# Altium schematic sheet 创世一号_主控.SchDoc
size 549 x 350 mm
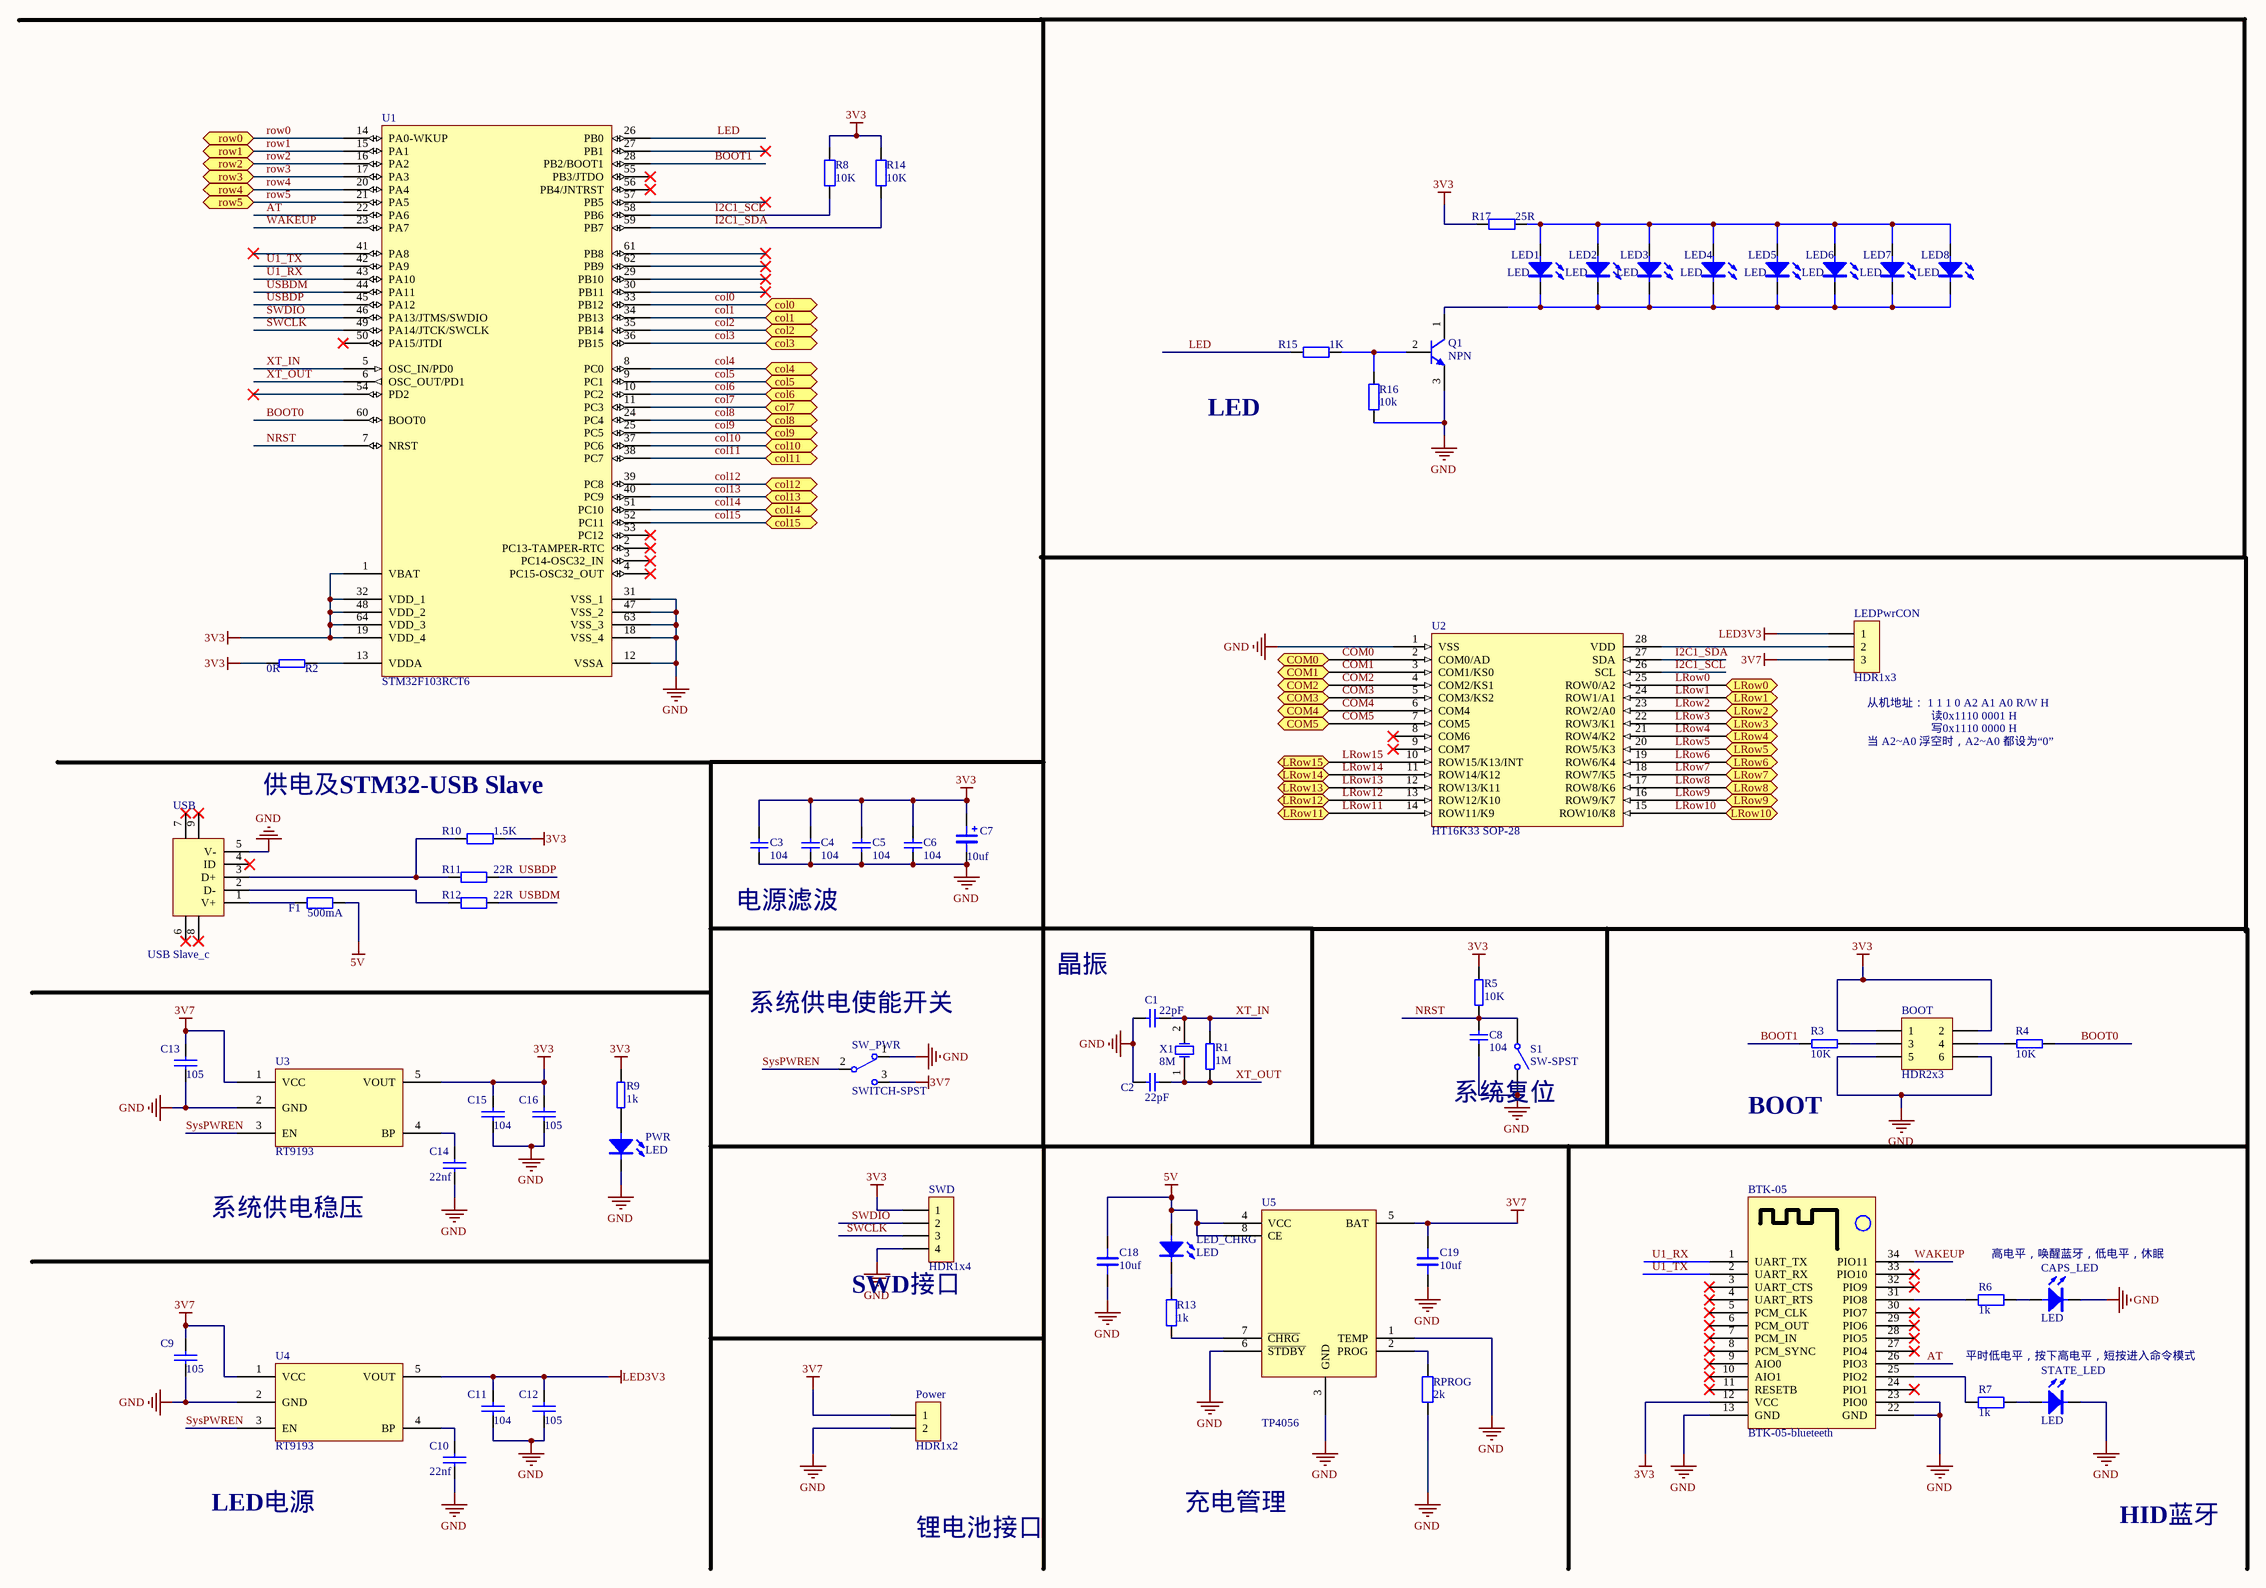
[diagram p0: 创世一号_主控.SchDoc]

## Parts
BOOT  HDR2x3  [PIN-2x3-2.54-1.0]
BTK-05  BTK-05-blueteeth  [BTK-05-bluteeth]
C1  22pF  [RC0603]
C2  22pF  [RC0603]
C3  104  [RC0603]
C4  104  [RC0603]
C5  104  [RC0603]
C6  104  [RC0603]
C7  10uf  [CAP0805]
C8  104  [RC0603]
C9  105  [0603]
C10  22nf  [0603]
C11  104  [0603]
C12  105  [0603]
C13  105  [0603]
C14  22nf  [0603]
C15  104  [0603]
C16  105  [0603]
C18  10uf  [0805]
C19  10uf  [0805]
CAPS_LED  LED  [LED-0805]
F1  500mA  [0805]
LED1  LED  [LED-0805]
LED2  LED  [LED-0805]
LED3  LED  [LED-0805]
LED4  LED  [LED-0805]
LED5  LED  [LED-0805]
LED6  LED  [LED-0805]
LED7  LED  [LED-0805]
LED8  LED  [LED-0805]
LED_CHRG  LED  [LED-0805]
LEDPwrCON  HDR1x3  [PIN-3-2.54-1.0]
Power  HDR1x2  [PIN-2-2.54-1.0]
PWR  LED  [LED-0805]
Q1  NPN  [S8050-TO-92]
R1  1M  [RC0603]
R2  0R  [RC0603]
R3  10K  [RC0603]
R4  10K  [RC0603]
R5  10K  [RC0603]
R6  1k  [0603]
R7  1k  [0603]
R8  10K  [0603]
R9  1k  [0603]
R10  1.5K  [0603]
R11  22R  [0603]
R12  22R  [0603]
R13  1k  [0603]
R14  10K  [0603]
R15  1K  [0603]
R16  10k  [0603]
R17  25R  [0603]
RPROG  2k  [0603]
S1  SW-SPST  [SMT-KEY]
STATE_LED  LED  [LED-0805]
SW_PWR  SWITCH-SPST  [Switch_3p_2.5mmjianju]
SWD  HDR1x4  [PIN-4-2.54-1.0]
U1  STM32F103RCT6  [QFP-64-0.5]
U2  HT16K33 SOP-28  [HT16K33-28PIN-SOP28]
U3  RT9193  [SOT-23-5]
U4  RT9193  [SOT-23-5]
U5  TP4056  [ESOP8]
USB  USB Slave_c  [MICRO USB CONNECTOR TYPEB-ST-MC-5F-01]
X1  8M  [HC49-SMD]

## Ports
col0 (bidir), col1 (bidir), col2 (bidir), col3 (bidir), col4 (bidir), col5 (bidir), col6 (bidir), col7 (bidir), col8 (bidir), col9 (bidir), col10 (bidir), col11 (bidir), col12 (bidir), col13 (bidir), col14 (bidir), col15 (bidir), COM0 (bidir), COM1 (bidir), COM2 (bidir), COM3 (bidir), COM4 (bidir), COM5 (bidir), LRow0 (bidir), LRow1 (bidir), LRow2 (bidir), LRow3 (bidir), LRow4 (bidir), LRow5 (bidir), LRow6 (bidir), LRow7 (bidir), LRow8 (bidir), LRow9 (bidir), LRow10 (bidir), LRow11 (bidir), LRow12 (bidir), LRow13 (bidir), LRow14 (bidir), LRow15 (bidir), row0 (bidir), row1 (bidir), row2 (bidir), row3 (bidir), row4 (bidir), row5 (bidir)

## Nets
3V3: BOOT.1 BOOT.2 BTK-05.12(VCC) C3.1 C4.1 C5.1 C6.1 C7.1 C15.1 C16.1 R2.2 R5.2 R8.1 R9.2 R10.1 R14.1 R17.2 SWD.1 U1.1(VBAT) U1.19(VDD_4) U1.32(VDD_1) U1.48(VDD_2) U1.64(VDD_3) U3.5(VOUT)
3V7: C9.1 C13.1 C19.2 LEDPwrCON.3 Power.1 SW_PWR.3 U3.1(VCC) U4.1(VCC) U5.5(BAT)
5V: C18.2 F1.1 LED_CHRG.1(A) U5.4(VCC) U5.8(CE)
GND: BOOT.5 BOOT.6 BTK-05.13(GND) BTK-05.22(GND) BTK-05.23(PIO0) C1.2 C2.2 C3.2 C4.2 C5.2 C6.2 C7.2 C8.2 C9.2 C10.2 C11.2 C12.2 C13.2 C14.2 C15.2 C16.2 C18.1 C19.1 CAPS_LED.2(C) Power.2 PWR.2(C) Q1.3(E) R16.2 RPROG.1 S1.2(NO) STATE_LED.2(C) SW_PWR.1 SWD.4 U1.12(VSSA) U1.18(VSS_4) U1.31(VSS_1) U1.47(VSS_2) U1.63(VSS_3) U2.1(VSS) U3.2(GND) U4.2(GND) U5.1(TEMP) U5.3(GND) U5.6(~{STDBY}) USB.5(V-)
LED3V3: C11.1 C12.1 LEDPwrCON.1 U4.5(VOUT)
AT: BTK-05.26(PIO3) U1.22(PA6)
BOOT0: R4.1 U1.60(BOOT0)
BOOT1: R3.2 U1.28(PB2/BOOT1)
col0: U1.33(PB12) ; port col0
col1: U1.34(PB13) ; port col1
col2: U1.35(PB14) ; port col2
col3: U1.36(PB15) ; port col3
col4: U1.8(PC0) ; port col4
col5: U1.9(PC1) ; port col5
col6: U1.10(PC2) ; port col6
col7: U1.11(PC3) ; port col7
col8: U1.24(PC4) ; port col8
col9: U1.25(PC5) ; port col9
col10: U1.37(PC6) ; port col10
col11: U1.38(PC7) ; port col11
col12: U1.39(PC8) ; port col12
col13: U1.40(PC9) ; port col13
col14: U1.51(PC10) ; port col14
col15: U1.52(PC11) ; port col15
COM0: U2.2(COM0/AD) ; port COM0
COM1: U2.3(COM1/KS0) ; port COM1
COM2: U2.4(COM2/KS1) ; port COM2
COM3: U2.5(COM3/KS2) ; port COM3
COM4: U2.6(COM4) ; port COM4
COM5: U2.7(COM5) ; port COM5
I2C1_SCL: R8.2 U1.58(PB6) U2.26(SCL)
I2C1_SDA: R14.2 U1.59(PB7) U2.27(SDA)
LED: R15.2 U1.26(PB0)
LRow0: U2.25(ROW0/A2) ; port LRow0
LRow1: U2.24(ROW1/A1) ; port LRow1
LRow2: U2.23(ROW2/A0) ; port LRow2
LRow3: U2.22(ROW3/K1) ; port LRow3
LRow4: U2.21(ROW4/K2) ; port LRow4
LRow5: U2.20(ROW5/K3) ; port LRow5
LRow6: U2.19(ROW6/K4) ; port LRow6
LRow7: U2.18(ROW7/K5) ; port LRow7
LRow8: U2.17(ROW8/K6) ; port LRow8
LRow9: U2.16(ROW9/K7) ; port LRow9
LRow10: U2.15(ROW10/K8) ; port LRow10
LRow11: U2.14(ROW11/K9) ; port LRow11
LRow12: U2.13(ROW12/K10) ; port LRow12
LRow13: U2.12(ROW13/K11) ; port LRow13
LRow14: U2.11(ROW14/K12) ; port LRow14
LRow15: U2.10(ROW15/K13/INT) ; port LRow15
NRST: C8.1 R5.1 S1.1(COMMON) U1.7(NRST)
row0: U1.14(PA0-WKUP) ; port row0
row1: U1.15(PA1) ; port row1
row2: U1.16(PA2) ; port row2
row3: U1.17(PA3) ; port row3
row4: U1.20(PA4) ; port row4
row5: U1.21(PA5) ; port row5
SWCLK: SWD.3 U1.49(PA14/JTCK/SWCLK)
SWDIO: SWD.2 U1.46(PA13/JTMS/SWDIO)
SysPWREN: SW_PWR.2 U3.3(EN) U4.3(EN)
U1_RX: BTK-05.1(UART_TX) U1.43(PA10)
U1_TX: BTK-05.2(UART_RX) U1.42(PA9)
USBDM: R12.1 U1.44(PA11)
USBDP: R11.1 U1.45(PA12)
WAKEUP: BTK-05.34(PIO11) U1.23(PA7)
XT_IN: C1.1 R1.2 U1.5(OSC_IN/PD0) X1.2
XT_OUT: C2.1 R1.1 U1.6(OSC_OUT/PD1) X1.1
NetBOOT_3: BOOT.3 R3.1
NetBOOT_4: BOOT.4 R4.2
NetBTK-05_25: BTK-05.25(PIO2) R7.1
NetBTK-05_31: BTK-05.31(PIO8) R6.1
NetC10_1: C10.1 U4.4(BP)
NetC14_1: C14.1 U3.4(BP)
NetCAPS_LED_1: CAPS_LED.1(A) R6.2
NetF1_2: F1.2 USB.1(V+)
NetLED1_1: LED1.1(A) LED2.1(A) LED3.1(A) LED4.1(A) LED5.1(A) LED6.1(A) LED7.1(A) LED8.1(A) R17.1
NetLED1_2: LED1.2(C) LED2.2(C) LED3.2(C) LED4.2(C) LED5.2(C) LED6.2(C) LED7.2(C) LED8.2(C) Q1.1(C)
NetLED_CHRG_2: LED_CHRG.2(C) R13.2
NetLEDPwrCON_2: LEDPwrCON.2 U2.28(VDD)
NetPWR_1: PWR.1(A) R9.1
NetQ1_2: Q1.2(B) R15.1 R16.1
NetR2_1: R2.1 U1.13(VDDA)
NetR7_2: R7.2 STATE_LED.1(A)
NetR10_2: R10.2 R11.2 USB.3(D+)
NetR12_2: R12.2 USB.2(D-)
NetR13_1: R13.1 U5.7(~{CHRG})
NetRPROG_2: RPROG.2 U5.2(PROG)

Not connected (* = marked no-connect by the designer): BTK-05 3(UART_CTS)* 4(UART_RTS)* 5(PCM_CLK)* 6(PCM_OUT)* 7(PCM_IN)* 8(PCM_SYNC)* 9(AIO0)* 10(AIO1)* 11(RESETB)* 24(PIO1)* 27(PIO4)* 28(PIO5)* 29(PIO6)* 30(PIO7)* 32(PIO9)* 33(PIO10)*; U1 2(PC13-TAMPER-RTC)* 3(PC14-OSC32_IN)* 4(PC15-OSC32_OUT)* 27(PB1)* 29(PB10)* 30(PB11)* 41(PA8)* 50(PA15/JTDI)* 53(PC12)* 54(PD2)* 55(PB3/JTDO)* 56(PB4/JNTRST)* 57(PB5)* 61(PB8)* 62(PB9)*; U2 8(COM6)* 9(COM7)*; USB 4(ID)* 6* 7* 8* 9*

## Notes on the sheet
- LED
- (near LEDPwrCON) 从机地址： 1 1 1 0 A2 A1 A0 R/W H
- 当 A2~A0 浮空时，A2~A0 都设为“0”
- 读0x1110 0001 H
- 写0x1110 0000 H
- 供电及STM32-USB Slave
- 电源滤波
- (near SW_PWR) 系统供电使能开关
- 晶振
- 系统复位
- (near R3) BOOT
- 系统供电稳压
- 高电平，唤醒蓝牙，低电平，休眠
- SWD接口
- 平时低电平，按下高电平，短按进入命令模式
- LED电源
- 锂电池接口
- 充电管理
- HID蓝牙

## Library data of the parts
BOOT = HDR2x3: Connector
C1 C2 = CAP1: Capacitor; Tolerate: 50V; Value: 20pF; TOL: 2%; ERP: 0103020090; PCB_Layout: Top Layer SMC; Revision: 2012-3-28; Publisher: ZL_A0OFFICE
C3-C6 C8 = CAP1: Capacitor; Tolerate: 50V; Value: 100nF; TOL: 10%; ERP: 0103020075; PCB_Layout: Top Layer SMC; Revision: 2012-3-28; Publisher: ZL_A0OFFICE
C7 = CAP-TANTALUM: Tantalum Capacitor
C9-C16 C18 C19 = CAP: Capacitor
F1 R8 R10-R12 R14-R17 = Res2: Resistor
LEDPwrCON = HDR1x3: Connector
Power = HDR1x2: Connector
Q1 = NPN: NPN Bipolar Transistor; Published: 8-Jun-2000; LatestRevisionDate: 17-Jul-2002; LatestRevisionNote: Re-released for DXP Platform.; PackageReference: TO-226-AA; Publisher: Altium Limited; PackageDescription: TO, Flat Index; 3 In-Line, Axial Leads; Body Dia. 4.8mm; Leads 0.55 x 0.51 mm (max); Code_JEDEC: TO-226-AA
R1-R5 R9 = R
R6 R7 R13 RPROG = RES: Resistor
S1 = SW-SPST: Single-Pole, Single-Throw Switch
SW_PWR = SWITCH-SPST: Switch
SWD = HDR1x4: Connector
U1 = STM32F103RxTx: MCU
USB = MICRO USB CONNECTOR TYPEB: USB Connector
X1 = XTAL_SMD: Crystal Oscillator; ERP: 0103040021; Value: 8MHz; TOL: ±20ppm; Tolerate: ROSON -20_+70 20pf; PCB_Layout: Top Layer SMC; Publisher: ZL_A0OFFICE; Revision: 2012-3-28